# EAGLE design pic32john (EAGLE 7.2.0)
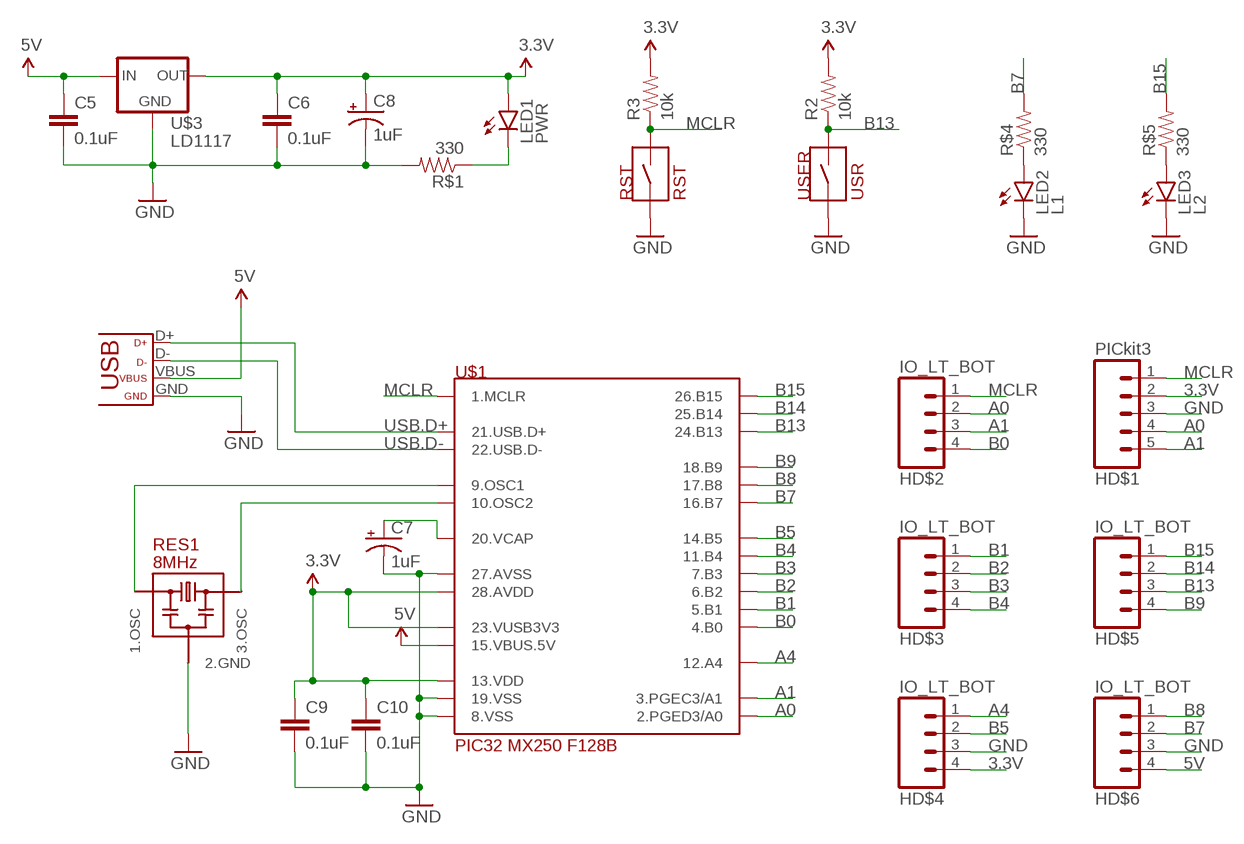
[diagram p0: schematic, sheet 1]

## Parts
C5  0.1uF  CAPPTH  [CAP-PTH-SMALL]
C6  0.1uF  CAPPTH  [CAP-PTH-SMALL]
C7  1uF  CAP_POLPTH2  [CPOL-RADIAL-10UF-25V]
C8  1uF  CAP_POLPTH2  [CPOL-RADIAL-10UF-25V]
C9  0.1uF  CAPPTH  [CAP-PTH-SMALL]
C10  0.1uF  CAPPTH  [CAP-PTH-SMALL]
HD$1  PICkit3  M05PTH  [1X05]
HD$2  IO_LT_BOT  M04PTH  [1X04]
HD$3  IO_LT_BOT  M04PTH  [1X04]
HD$4  IO_LT_BOT  M04PTH  [1X04]
HD$5  IO_LT_BOT  M04PTH  [1X04]
HD$6  IO_LT_BOT  M04PTH  [1X04]
LED1  PWR  LED3MM  [LED3MM]
LED2  L1  LED3MM  [LED3MM]
LED3  L2  LED3MM  [LED3MM]
R2  10k  RESISTORPTH-1/4W  [AXIAL-0.4]
R3  10k  RESISTORPTH-1/4W  [AXIAL-0.4]
R$1  330  RESISTORPTH-1/4W  [AXIAL-0.4]
R$4  330  RESISTORPTH-1/4W  [AXIAL-0.4]
R$5  330  RESISTORPTH-1/4W  [AXIAL-0.4]
RES1  8MHz  RESONATOR  [RESONATOR_PTH]
RST  RST  BTN_P8072  [BTN_P8072]
U$1  PIC32MX250F128B  [DIL_28_3_JOHN]
U$2  USB  [USB-MINIB]
U$3  LD1117  [TO220]
USER  USR  BTN_P8072  [BTN_P8072]

## Nets
3.3V: C6.1 C8.1(+) C9.1 C10.1 HD$1.2 HD$4.4 LED1.A R2.P$2 R3.P$2 U$1.P$13(13.VDD) U$1.P$23(23.VUSB3V3) U$1.P$28(28.AVDD) U$3.2(OUT)
5V: C5.1 HD$6.4 U$1.P$15(15.VBUS.5V) U$2.VBUS U$3.3(IN)
A0: HD$1.4 HD$2.2 U$1.P$2(2.PGED3/A0)
A1: HD$1.5 HD$2.3 U$1.P$3(3.PGEC3/A1)
A4: HD$4.1 U$1.P$12(12.A4)
B0: HD$2.4 U$1.P$4(4.B0)
B1: HD$3.1 U$1.P$5(5.B1)
B2: HD$3.2 U$1.P$6(6.B2)
B3: HD$3.3 U$1.P$7(7.B3)
B4: HD$3.4 U$1.P$11(11.B4)
B5: HD$4.2 U$1.P$14(14.B5)
B7: HD$6.2 R$4.P$2 U$1.P$16(16.B7)
B8: HD$6.1 U$1.P$17(17.B8)
B9: HD$5.4 U$1.P$18(18.B9)
B13: HD$5.3 R2.P$1 U$1.P$24(24.B13) USER.P$2
B14: HD$5.2 U$1.P$25(25.B14)
B15: HD$5.1 R$5.P$2 U$1.P$26(26.B15)
GND: C5.2 C6.2 C7.2(-) C8.2(-) C9.2 C10.2 HD$1.3 HD$4.3 HD$6.3 LED2.K(C) LED3.K(C) R$1.P$2 RES1.P$2(2.GND) RST.P$1 U$1.P$8(8.VSS) U$1.P$19(19.VSS) U$1.P$27(27.AVSS) U$2.GND U$3.1(GND) USER.P$1
MCLR: HD$1.1 HD$2.1 R3.P$1 RST.P$2 U$1.P$1(1.MCLR)
N$1: RES1.P$3(1.OSC) U$1.P$9(9.OSC1)
N$2: RES1.P$1(3.OSC) U$1.P$10(10.OSC2)
N$3: LED1.K(C) R$1.P$1
N$4: LED2.A R$4.P$1
N$5: C7.1(+) U$1.P$20(20.VCAP)
N$6: LED3.A R$5.P$1
USB.D+: U$1.P$21(21.USB.D+) U$2.D+
USB.D-: U$1.P$22(22.USB.D-) U$2.D-

## Library data of the parts
C5 C6 C9 C10 = john433:CAP: Capacitor Standard 0603 ceramic capacitor, and 0.1" leaded capacitor.
C7 C8 = SparkFun-Capacitors:CAP_POL: Capacitor Polarized These are standard SMD and PTH capacitors. Normally 10uF, 47uF, and 100uF in electrolytic and tantalum varieties. Always verify the external diameter of the through hole cap, it varies with capacity, voltage, and manufacturer. The EIA devices should be standard.
HD$1 = SparkFun-Connectors:M05: Header 5 Standard 5-pin 0.1" header. Use with straight break away headers (SKU : PRT-00116), right angle break away headers (PRT-00553), swiss pins (PRT-00743), machine pins (PRT-00117), and female headers (PRT-00115). Molex polarized connector foot print use with SKU : PRT-08230 with associated crimp pins and housings.
HD$2-HD$6 = SparkFun-Connectors:M04: Header 4 Standard 4-pin 0.1" header. Use with straight break away headers (SKU : PRT-00116), right angle break away headers (PRT-00553), swiss pins (PRT-00743), machine pins (PRT-00117), and female headers (PRT-00115). Molex polarized connector foot print use with SKU : PRT-08231 with associated crimp pins and housings. 1MM SMD Version SKU: PRT-10208
LED1-LED3 = john433:LED: LEDs Standard schematic elements and footprints for 5mm, 3mm, 1206, and 0603 sized LEDs. 5mm - Spark Fun Electronics SKU : COM-00529 (and others)
R2 R3 R$1 R$4 R$5 = john433:RESISTOR: Resistor Basic schematic elements and footprints for 0603, 1206, and PTH resistors.
RES1 = john433:RESONATOR
RST USER = john433:BTN_P8072
U$1 = john433:PIC32MX250F128B
U$2 = ME433:USB
U$3 = ME433:LD1117

## Board
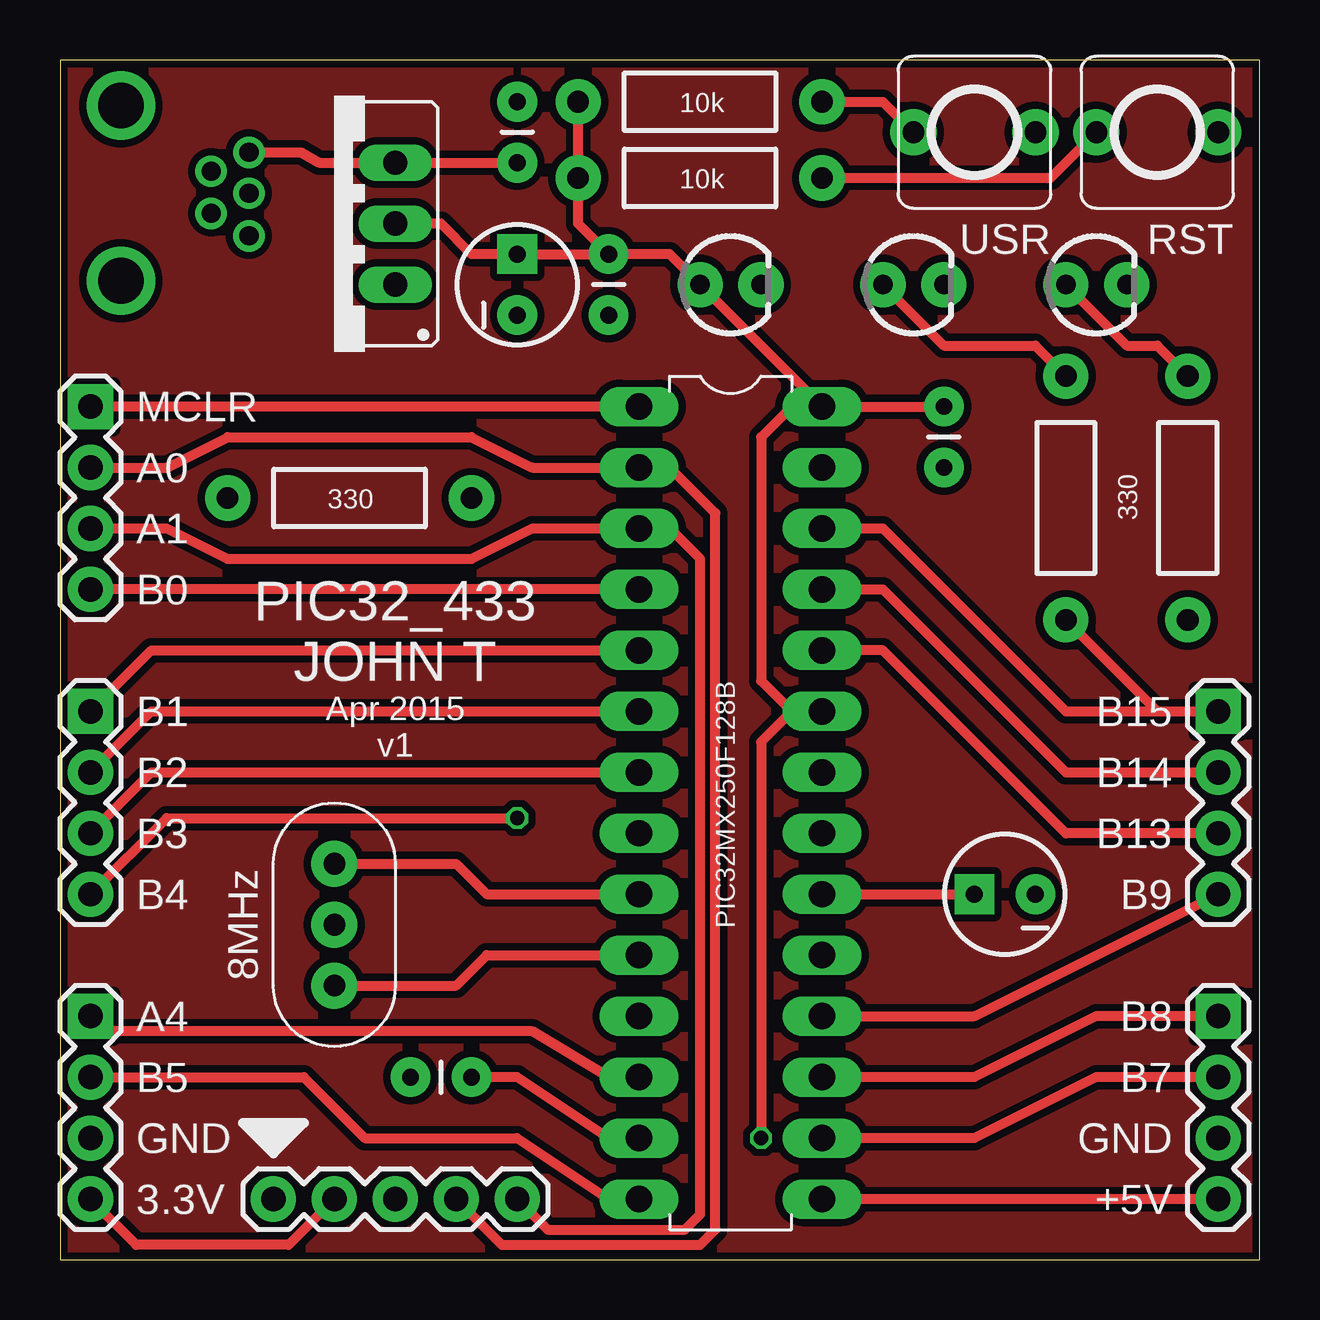
[diagram p1: board, top side]
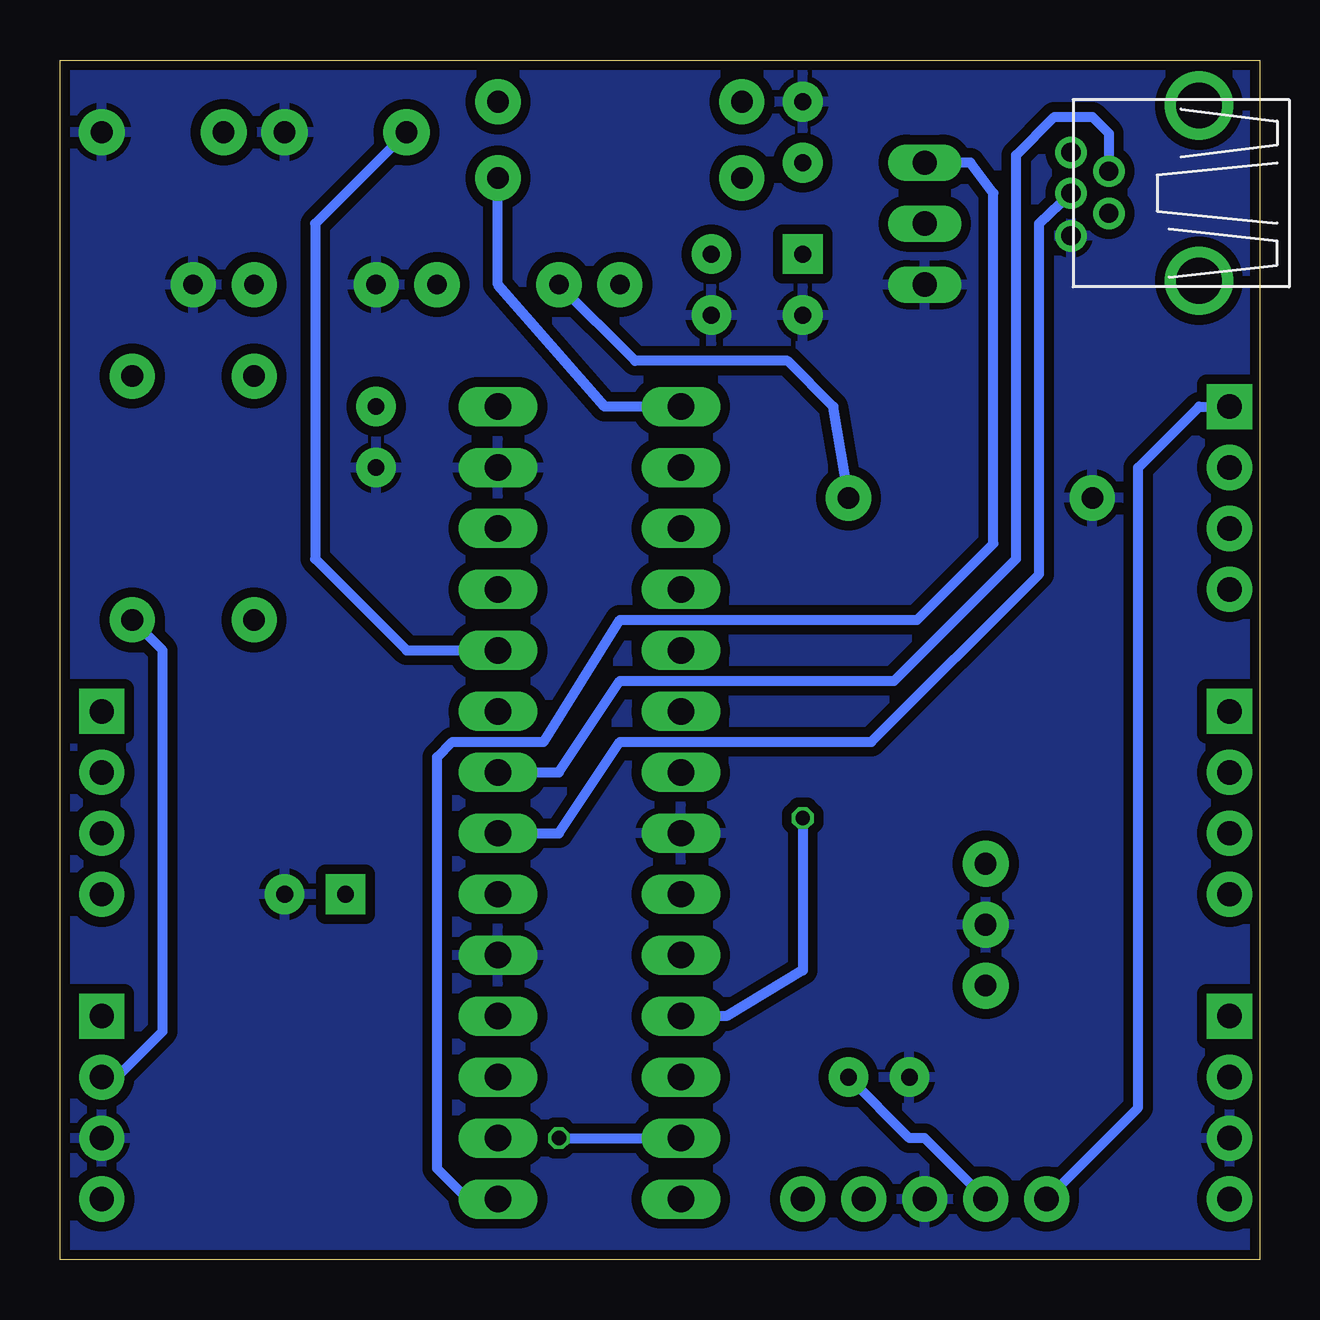
[diagram p2: board, bottom side, seen from below]

Size 50 x 50 mm. Coordinates in mm from the lower left corner, seen from the top.
Outline: 0,0 50,0 50,50 0,50 0,0
Copper layers (1*16): Top 0.035mm / dielectric 1.5mm / Bottom 0.035mm
Design rules "SeeedStudio_2layer_DRU_no_angle_20140221": minimum track width 6mil, minimum drill 12mil, track to track 6mil, track to pad 6mil, pad to pad 6mil, via to via 6mil, smd to smd 0mil, copper to edge 10mil, drill to drill 10mil, minimum pad ring 10mil, minimum via ring 6mil, stop-mask expansion 2mil, vias tented up to drill 100mil, thermal gap 10mil

### Footprints (pad centres in the part's own frame; a part is rotated, then mirrored left to right if it is on the bottom)
CAP-PTH-SMALL = drill 0.7 pad 1.651: 1 0,0; 2 2.54,0
CPOL-RADIAL-10UF-25V = drill 0.7 pad 1.651 square: 1 1.27,0 | drill 0.7 pad 1.651: 2 -1.27,0
1X05 = drill 1.016 pad 1.88: 1 0,0; 2 2.54,0; 3 5.08,0; 4 7.62,0; 5 10.16,0
1X04 = drill 1.016 pad 1.88 square: 1 0,0 | drill 1.016 pad 1.88: 2 2.54,0; 3 5.08,0; 4 7.62,0
LED3MM = drill 0.813 pad 1.88: A -1.27,0; K 1.27,0
AXIAL-0.4 = drill 0.9 pad 1.88: P$1 -5.08,0; P$2 5.08,0
RESONATOR_PTH = drill 0.9 pad 1.93: P$1 0,0; P$2 2.54,0; P$3 5.08,0
BTN_P8072 = drill 0.9 pad 1.93: P$1 0,0; P$2 5.08,0
DIL_28_3_JOHN = drill 1.1 long: P$1 0,0; P$2 0,-2.54; P$3 0,-5.08; P$4 0,-7.62; P$5 0,-10.16; P$6 0,-12.7; P$7 0,-15.24; P$8 0,-17.78; P$9 0,-20.32; P$10 0,-22.86; P$11 0,-25.4; P$12 0,-27.94; P$13 0,-30.48; P$14 0,-33.02; P$15 7.62,-33.02; P$16 7.62,-30.48; P$17 7.62,-27.94; P$18 7.62,-25.4; P$19 7.62,-22.86; P$20 7.62,-20.32; P$21 7.62,-17.78; P$22 7.62,-15.24; P$23 7.62,-12.7; P$24 7.62,-10.16; P$25 7.62,-7.62; P$26 7.62,-5.08; P$27 7.62,-2.54; P$28 7.62,0
USB-MINIB = drill 0.8: D+ 4.064,0; D- 2.489,0.914; GND 4.064,-1.778; ID 2.489,-0.838; VBUS 4.064,1.702 | drill 1.9: P$6 -1.27,-3.65; P$7 -1.27,3.65
TO220 = drill 1.016 long: 1 -2.54,0; 2 0,0; 3 2.54,0

### Placement (x,y rotation side)
C5  19.05,45.72 90 top
C6  22.86,41.91 270 top
C7  39.37,15.24 180 top
C8  19.05,40.64 90 top
C9  17.14,7.62 180 top
C10  36.83,35.56 270 top
HD$1  8.89,2.54 0 top
HD$2  1.27,35.56 270 top
HD$3  1.27,22.86 270 top
HD$4  1.27,10.16 270 top
HD$5  48.26,22.86 270 top
HD$6  48.26,10.16 270 top
LED1  27.94,40.64 0 top
LED2  43.18,40.64 0 top
LED3  35.56,40.64 0 top
R2  26.67,48.26 180 top
R3  26.67,45.09 180 top
R$1  12.06,31.75 180 top
R$4  46.99,31.75 270 top
R$5  41.91,31.75 270 top
RES1  11.43,11.43 90 top
RST  48.26,46.99 180 top
U$1  24.13,35.56 0 top
U$2  3.81,44.45 0 top
U$3  13.97,43.18 90 top
USER  40.64,46.99 180 top

### Tracks (layer width: path | path; a pad name or v marks a point on that pad's centre or on a via)
3.3V  (via drill 0.6)
  Top 0.406: HD$1.2 9.53,0.64 3.17,0.64 HD$4.4 | U$1.P$13 22.86,5.08 19.05,7.62 C9.1 | U$1.P$28 C10.1 | U$1.P$28 LED1.A 25.4,41.91 C6.1 | C6.1 21.59,43.18 R3.P$2 R2.P$2 | C6.1 C8.1 17.14,41.91 15.88,43.18 U$3.2 | U$1.P$23 30.48,22.86 | 30.48,22.86 29.21,21.59 v29.21,5.08 | U$1.P$28 30.48,35.56 29.21,34.29 29.21,24.13 30.48,22.86
  Bottom 0.406: HD$1.2 13.97,5.08 14.61,5.08 C9.1 | v29.21,5.08 U$1.P$13
5V
  Top 0.406: C5.1 U$3.3 10.79,45.72 10.05,46.15 U$2.VBUS | HD$6.4 U$1.P$15
  Bottom 0.406: U$1.P$15 33.02,2.54 34.29,3.81 34.29,20.95 33.66,21.59 29.84,21.59 26.67,26.67 14.29,26.67 11.11,29.84 11.11,44.45 12.06,45.72 U$3.3
A0
  Top 0.406: HD$2.2 4.45,33.02 6.99,34.29 17.14,34.29 19.68,33.02 U$1.P$2 25.4,33.02 27.3,31.11 27.3,1.27 26.67,0.64 18.41,0.64 HD$1.4
A1
  Top 0.406: HD$2.3 4.45,30.48 6.99,29.21 17.14,29.21 19.68,30.48 U$1.P$3 25.4,30.48 26.67,29.21 26.67,1.91 26.04,1.27 20.32,1.27 HD$1.5
A4
  Top 0.406: U$1.P$12 22.86,7.62 19.68,9.53 1.91,9.53 HD$4.1
B0
  Top 0.406: U$1.P$4 HD$2.4
B1
  Top 0.406: HD$3.1 3.81,25.4 U$1.P$5
B2
  Top 0.406: HD$3.2 3.81,22.86 U$1.P$6
B3
  Top 0.406: HD$3.3 3.81,20.32 U$1.P$7
B4  (via drill 0.6)
  Top 0.406: HD$3.4 4.45,18.41 v19.05,18.41
  Bottom 0.406: v19.05,18.41 19.05,12.06 22.23,10.16 U$1.P$11
B5
  Top 0.406: HD$4.2 10.16,7.62 12.7,5.08 19.05,5.08 22.86,2.54 U$1.P$14
B7
  Top 0.406: HD$6.2 43.18,7.62 38.1,5.08 U$1.P$16
  Bottom 0.406: HD$6.2 47.62,7.62 45.72,9.53 45.72,25.4 R$4.P$2
B8
  Top 0.406: HD$6.1 43.18,10.16 38.1,7.62 U$1.P$17
B9
  Top 0.406: U$1.P$18 38.1,10.16 HD$5.4
B13
  Top 0.406: R2.P$1 34.29,48.26 USER.P$2 | HD$5.3 41.91,17.78 34.29,25.4 U$1.P$24
  Bottom 0.406: USER.P$2 39.37,43.18 39.37,29.21 35.56,25.4 U$1.P$24
B14
  Top 0.406: U$1.P$25 34.29,27.94 41.91,20.32 HD$5.2
B15
  Top 0.406: U$1.P$26 34.29,30.48 41.91,22.86 HD$5.1 45.72,22.86 R$5.P$2
GND
  pour Bottom (isolate 0.406): 0,0 0,50.16 50.16,50.16 50.16,0
MCLR
  Top 0.406: U$1.P$1 HD$2.1 | R3.P$1 41.27,45.09 RST.P$2
  Bottom 0.406: U$1.P$1 27.3,35.56 31.75,40.64 R3.P$1 | HD$1.1 5.08,6.35 5.08,33.02 2.54,35.56 HD$2.1
N$1
  Top 0.406: RES1.P$3 16.51,16.51 17.78,15.24 U$1.P$9
N$2
  Top 0.406: RES1.P$1 16.51,11.43 17.78,12.7 U$1.P$10
N$3
  Bottom 0.406: R$1.P$1 17.78,35.56 19.68,37.47 26.04,37.47 LED1.K
N$4
  Top 0.406: LED2.A 44.45,38.1 45.72,38.1 R$4.P$1
N$5
  Top 0.406: U$1.P$20 C7.1
N$6
  Top 0.406: LED3.A 36.83,38.1 40.64,38.1 R$5.P$1
TOPFILL
  pour Top (isolate 0.305): 0,0 0,50.16 50.16,50.16 50.16,0
USB.D+
  Bottom 0.406: U$1.P$21 29.21,17.78 26.67,21.59 16.19,21.59 9.21,28.57 9.21,43.18 U$2.D+
USB.D-
  Bottom 0.406: U$1.P$22 29.21,20.32 26.67,24.13 15.24,24.13 10.16,29.21 10.16,46.04 8.57,47.62 6.99,47.62 6.3,46.94 U$2.D-

### Text on the board
tPlace: MCLR / A0 / A1 / B0 | PIC32_433 / JOHN T | B1 / B2 / B3 / B4 | Apr 2015 / v1 | B15 / B14 / B13 / B9 | A4 / B5 / GND / 3.3V | B8 / B7 / GND / +5V